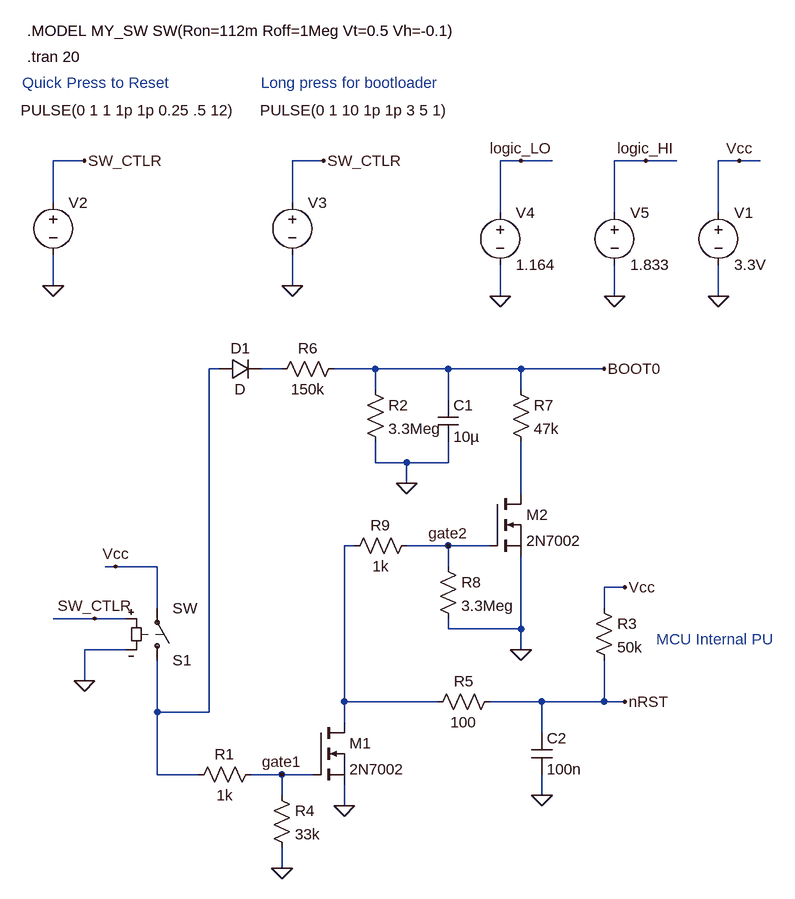
[diagram p0: schematic Reset_double_FET.asc]
Reset_double_FET.asc, the LTspice schematic file:
Version 4
SHEET 1 1704 832
WIRE 416 -560 368 -560
WIRE 784 -560 736 -560
WIRE 1088 -560 1056 -560
WIRE 1136 -560 1088 -560
WIRE 1280 -560 1232 -560
WIRE 1328 -560 1280 -560
WIRE 1424 -560 1392 -560
WIRE 1456 -560 1424 -560
WIRE 368 -496 368 -560
WIRE 736 -496 736 -560
WIRE 1056 -480 1056 -560
WIRE 1232 -480 1232 -560
WIRE 1392 -480 1392 -560
WIRE 368 -368 368 -416
WIRE 736 -368 736 -416
WIRE 1056 -352 1056 -400
WIRE 1232 -352 1232 -400
WIRE 1392 -352 1392 -400
WIRE 624 -240 608 -240
WIRE 720 -240 688 -240
WIRE 864 -240 800 -240
WIRE 976 -240 864 -240
WIRE 1088 -240 976 -240
WIRE 1216 -240 1088 -240
WIRE 864 -208 864 -240
WIRE 1088 -208 1088 -240
WIRE 976 -192 976 -240
WIRE 864 -96 864 -128
WIRE 912 -96 864 -96
WIRE 976 -96 976 -128
WIRE 976 -96 912 -96
WIRE 912 -64 912 -96
WIRE 1088 -48 1088 -128
WIRE 832 32 816 32
WIRE 976 32 912 32
WIRE 1040 32 976 32
WIRE 464 64 448 64
WIRE 528 64 464 64
WIRE 976 64 976 32
WIRE 1248 96 1216 96
WIRE 528 128 528 64
WIRE 1216 128 1216 96
WIRE 432 144 368 144
WIRE 480 144 432 144
WIRE 976 160 976 144
WIRE 1088 160 1088 48
WIRE 1088 160 976 160
WIRE 480 192 416 192
WIRE 1088 192 1088 160
WIRE 416 240 416 192
WIRE 816 272 816 32
WIRE 960 272 816 272
WIRE 1120 272 1040 272
WIRE 1216 272 1216 208
WIRE 1216 272 1120 272
WIRE 1248 272 1216 272
WIRE 528 288 528 208
WIRE 608 288 608 -240
WIRE 608 288 528 288
WIRE 816 304 816 272
WIRE 1120 320 1120 272
WIRE 528 384 528 288
WIRE 592 384 528 384
WIRE 720 384 672 384
WIRE 768 384 720 384
WIRE 720 416 720 384
WIRE 1120 416 1120 384
WIRE 816 432 816 400
WIRE 720 528 720 496
FLAG 368 -368 0
FLAG 416 240 0
FLAG 432 144 SW_CTLR
FLAG 416 -560 SW_CTLR
FLAG 816 432 0
FLAG 1120 416 0
FLAG 912 -64 0
FLAG 1392 -352 0
FLAG 1248 272 nRST
FLAG 1216 -240 BOOT0
FLAG 720 528 0
FLAG 720 384 gate1
FLAG 736 -368 0
FLAG 784 -560 SW_CTLR
FLAG 1056 -352 0
FLAG 1232 -352 0
FLAG 1088 -560 logic_LO
FLAG 1280 -560 logic_HI
FLAG 1424 -560 Vcc
FLAG 1248 96 Vcc
FLAG 464 64 Vcc
FLAG 1088 192 0
FLAG 976 32 gate2
SYMBOL Voltage 368 -512 R0
WINDOW 3 -50 -126 Left 2
SYMATTR Value PULSE(0 1 1 1p 1p 0.25 .5 12)
SYMATTR InstName V2
SYMATTR SpiceLine Rser=1m
SYMBOL sw 528 224 M180
SYMATTR InstName S1
SYMATTR SpiceModel MY_SW
SYMBOL Res 848 -224 R0
SYMATTR InstName R2
SYMATTR Value 3.3Meg
SYMBOL Cap 960 -192 R0
SYMATTR InstName C1
SYMATTR Value 10µ
SYMBOL Diode 624 -224 R270
WINDOW 0 32 32 VTop 2
WINDOW 3 0 32 VBottom 2
SYMATTR InstName D1
SYMBOL Res 688 368 R90
WINDOW 0 0 56 VBottom 2
WINDOW 3 32 56 VTop 2
SYMATTR InstName R1
SYMATTR Value 1k
SYMBOL Cap 1104 320 R0
SYMATTR InstName C2
SYMATTR Value 100n
SYMBOL nmos 768 304 R0
SYMATTR InstName M1
SYMATTR Value 2N7002
SYMBOL Voltage 1392 -496 R0
SYMATTR InstName V1
SYMATTR Value 3.3V
SYMBOL Res 1200 112 R0
SYMATTR InstName R3
SYMATTR Value 50k
SYMBOL Res 704 400 R0
SYMATTR InstName R4
SYMATTR Value 33k
SYMBOL Res 816 -256 R90
WINDOW 0 0 56 VBottom 2
WINDOW 3 32 56 VTop 2
SYMATTR InstName R6
SYMATTR Value 150k
SYMBOL Res 1056 256 R90
WINDOW 0 0 56 VBottom 2
WINDOW 3 32 56 VTop 2
SYMATTR InstName R5
SYMATTR Value 100
SYMBOL Voltage 736 -512 R0
WINDOW 3 -50 -126 Left 2
SYMATTR Value PULSE(0 1 10 1p 1p 3 5 1)
SYMATTR InstName V3
SYMATTR SpiceLine Rser=1m
SYMBOL Voltage 1056 -496 R0
SYMATTR InstName V4
SYMATTR Value 1.164
SYMBOL Voltage 1232 -496 R0
SYMATTR InstName V5
SYMATTR Value 1.833
SYMBOL nmos 1040 -48 R0
SYMATTR InstName M2
SYMATTR Value 2N7002
SYMBOL Res 1072 -224 R0
SYMATTR InstName R7
SYMATTR Value 47k
SYMBOL Res 960 48 R0
SYMATTR InstName R8
SYMATTR Value 3.3Meg
SYMBOL Res 928 16 R90
WINDOW 0 0 56 VBottom 2
WINDOW 3 32 56 VTop 2
SYMATTR InstName R9
SYMATTR Value 1k
TEXT 328 -760 Left 2 !.MODEL MY_SW SW(Ron=112m Roff=1Meg Vt=0.5 Vh=-0.1)
TEXT 328 -720 Left 2 !.tran 20
TEXT 320 -680 Left 2 ;Quick Press to Reset
TEXT 688 -680 Left 2 ;Long press for bootloader
TEXT 1296 176 Left 2 ;MCU Internal PU

The netlist it stands for:
* Reset_double_FET.asc
V2 SW_CTLR 0 PULSE(0 1 1 1p 1p 0.25 .5 12) Rser=1m
S1 N001 Vcc SW_CTLR 0 MY_SW SW
R2 BOOT0 0 3.3Meg
C1 BOOT0 0 10µ
D1 N001 N002 D
R1 gate1 N001 1k
C2 nRST 0 100n
M1 N004 gate1 0 0 2N7002
V1 Vcc 0 3.3V
R3 Vcc nRST 50k
R4 gate1 0 33k
R6 BOOT0 N002 150k
R5 nRST N004 100
V3 SW_CTLR 0 PULSE(0 1 10 1p 1p 3 5 1) Rser=1m
V4 logic_LO 0 1.164
V5 logic_HI 0 1.833
M2 N003 gate2 0 0 2N7002
R7 BOOT0 N003 47k
R8 gate2 0 3.3Meg
R9 gate2 N004 1k
.model D D
.lib standard.dio
.model NMOS NMOS
.model PMOS PMOS
.lib standard.mos
.MODEL MY_SW SW(Ron=112m Roff=1Meg Vt=0.5 Vh=-0.1)
.tran 20
* Quick Press to Reset
* Long press for bootloader
* MCU Internal PU
.backanno
.end